# EasyEDA Pro project 干电池充电器.eprj, schematic Schematic1
Board Name: Board1; Create Date: 2025-11-15; Page Name: P1; Project Name: 干电池充电器; Schematic Name: Schematic1; Update Date: 2025-11-17; Company: 嘉立创EDA; Page Size: A4; Version: V1.0
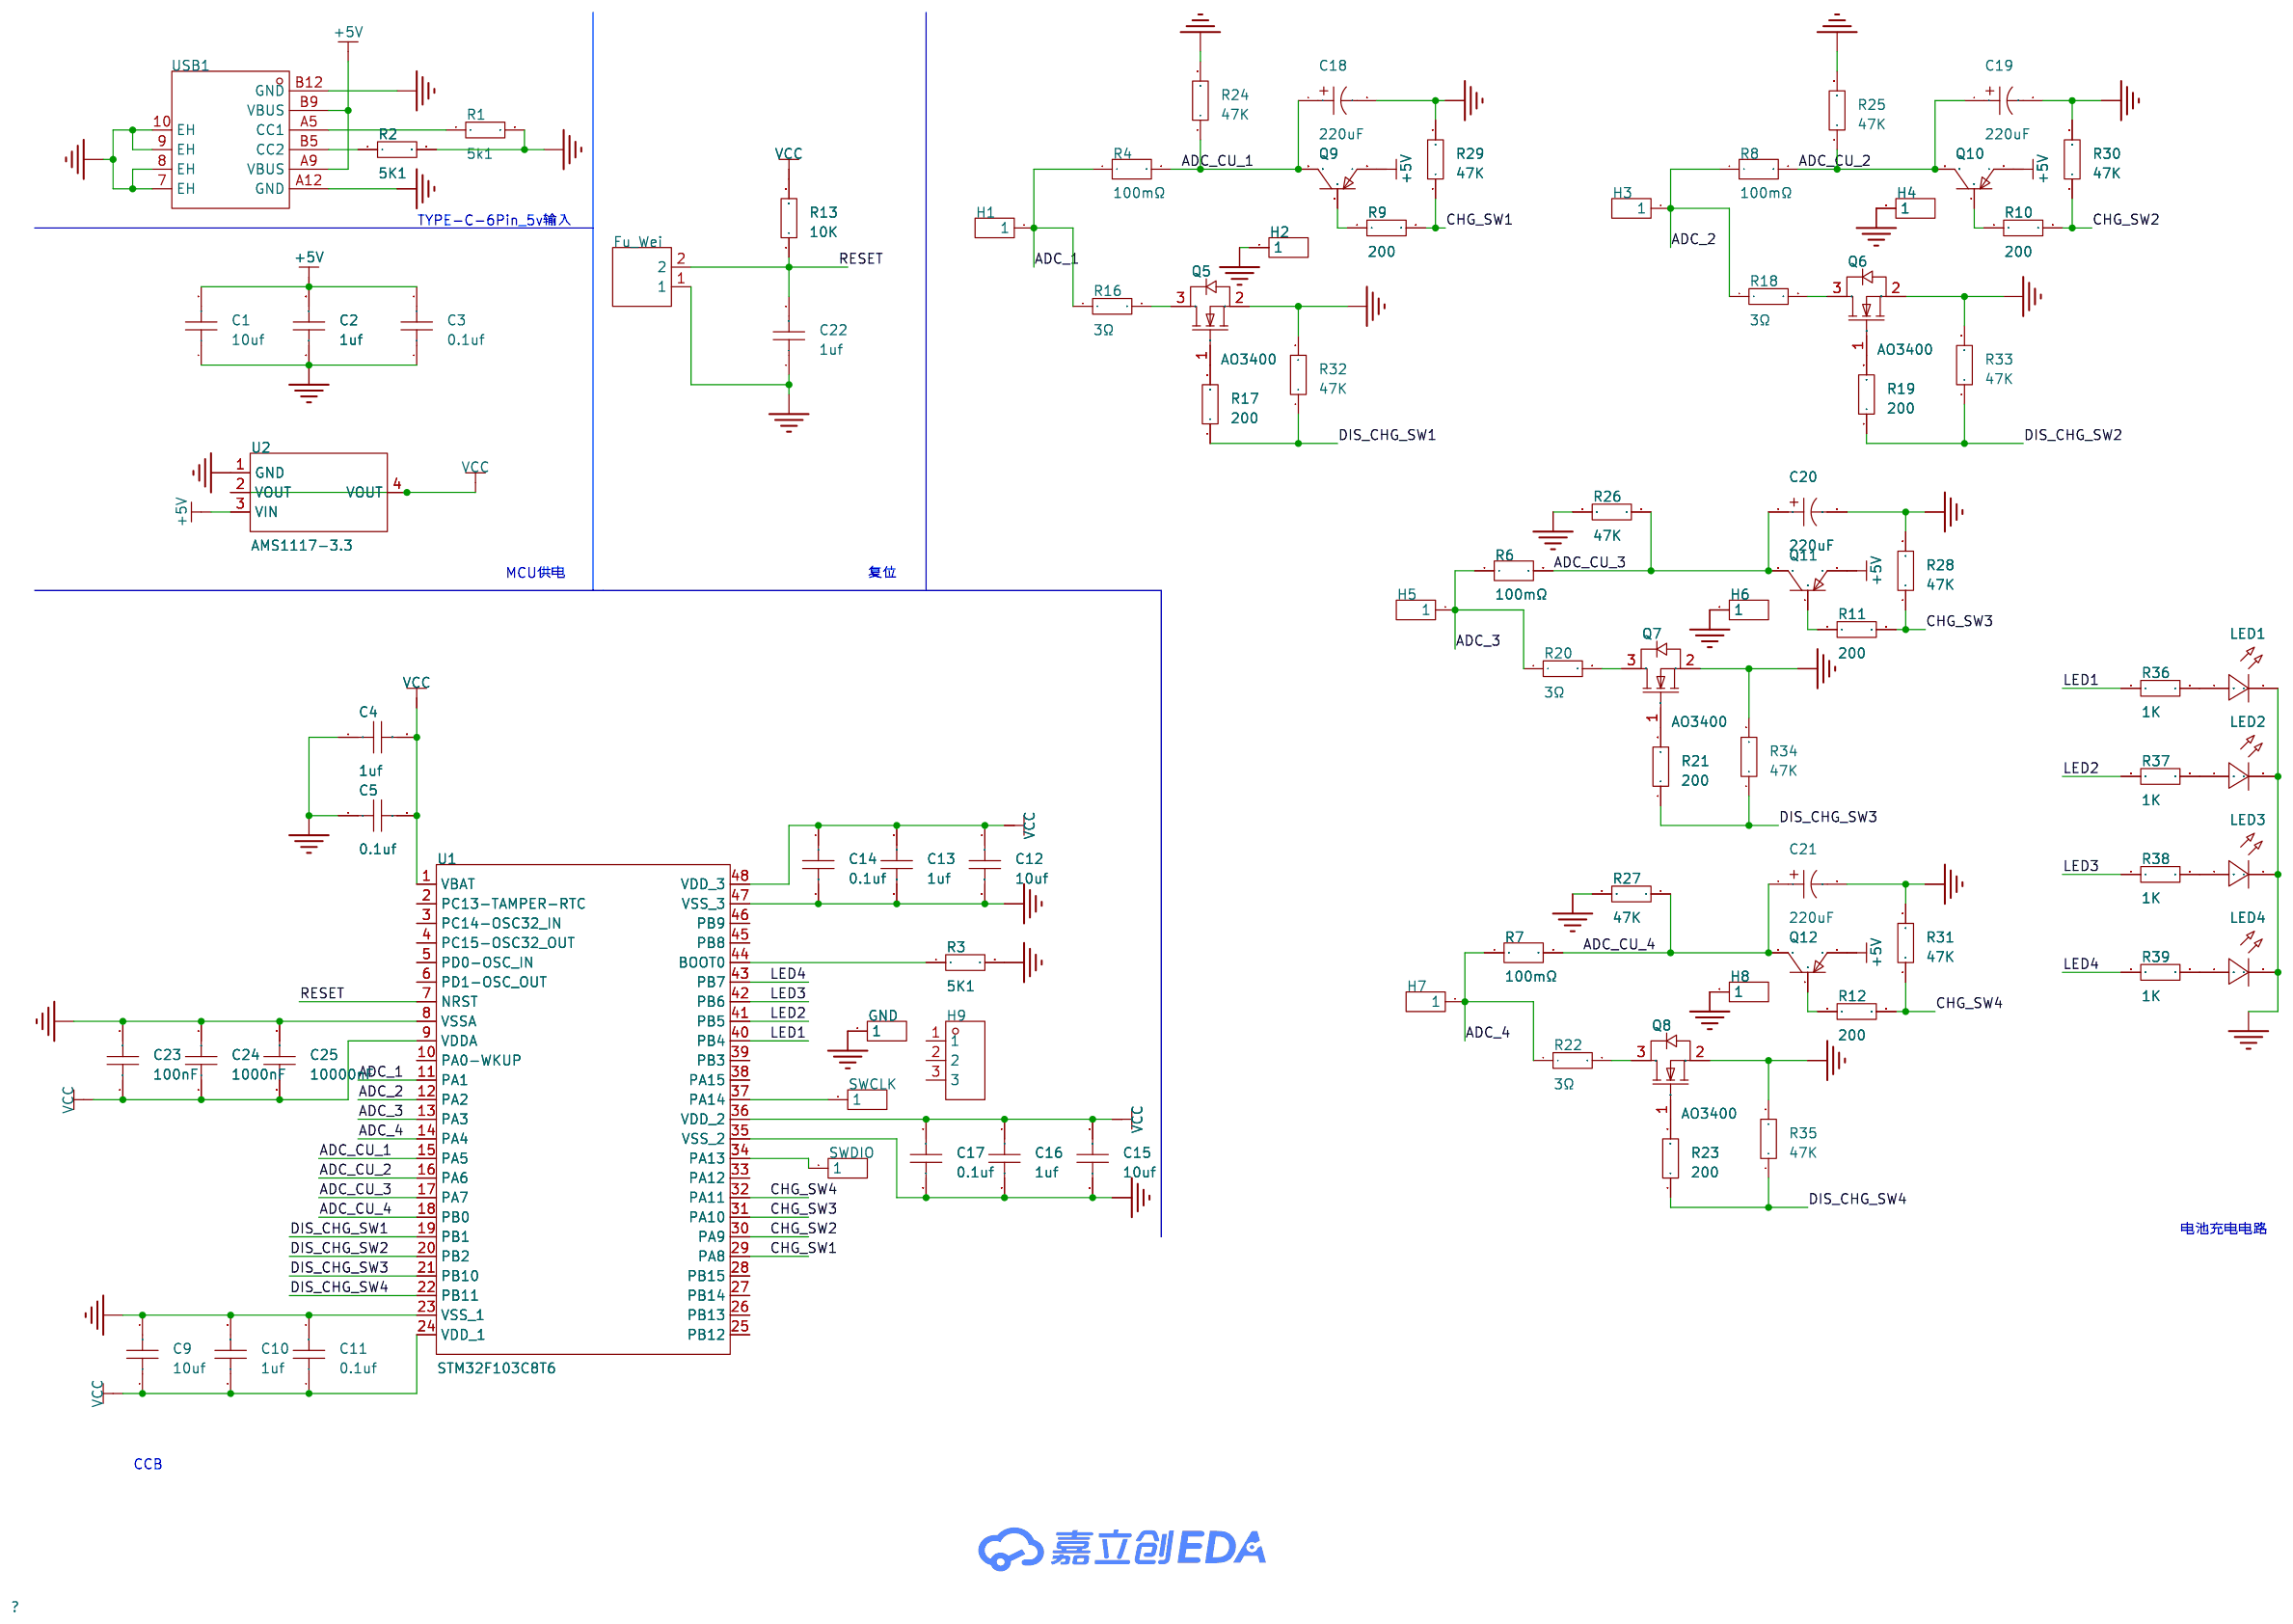
[diagram p0: schematic sheet]

## Parts
C1  10uf  [D0805]
C2  1uf  [D0805]
C3  0.1uf  [D0805]
C4  1uf  [D0805]
C5  0.1uf  [D0805]
C9  10uf  [D0805]
C10  1uf  [D0805]
C11  0.1uf  [D0805]
C12  10uf  [D0805]
C13  1uf  [D0805]
C14  0.1uf  [D0805]
C15  10uf  [D0805]
C16  1uf  [D0805]
C17  0.1uf  [D0805]
C18  220uF  [CAP-SMD_L6.0-W3.2]
C19  220uF  [CAP-SMD_L6.0-W3.2]
C20  220uF  [CAP-SMD_L6.0-W3.2]
C21  220uF  [CAP-SMD_L6.0-W3.2]
C22  1uf  [C0805]
C23  100nF  [C0805]
C24  1000nF  [C0805]
C25  10000nF  [C0805]
Fu_Wei  -  [HDR-TH_2P-P2.54-V-M-1]
GND  -  [HDR-TH_1P-V-M_XKB_X4611WV-01I-C28D40]
H1  -  [HDR-TH_1P-V-M_XKB_X4611WV-01I-C28D40]
H2  -  [HDR-TH_1P-V-M_XKB_X4611WV-01I-C28D40]
H3  -  [HDR-TH_1P-V-M_XKB_X4611WV-01I-C28D40]
H4  -  [HDR-TH_1P-V-M_XKB_X4611WV-01I-C28D40]
H5  -  [HDR-TH_1P-V-M_XKB_X4611WV-01I-C28D40]
H6  -  [HDR-TH_1P-V-M_XKB_X4611WV-01I-C28D40]
H7  -  [HDR-TH_1P-V-M_XKB_X4611WV-01I-C28D40]
H8  -  [HDR-TH_1P-V-M_XKB_X4611WV-01I-C28D40]
H9  -  [HDR-TH_3P-P2.54-V-M]
LED1  -  [LED_TH-3mm]
LED2  -  [LED_TH-3mm]
LED3  -  [LED_TH-3mm]
LED4  -  [LED_TH-3mm]
Q5  AO3400  [SOT-23_L2.9-W1.3-P1.90-LS2.4-BR]
Q6  AO3400  [SOT-23_L2.9-W1.3-P1.90-LS2.4-BR]
Q7  AO3400  [SOT-23_L2.9-W1.3-P1.90-LS2.4-BR]
Q8  AO3400  [SOT-23_L2.9-W1.3-P1.90-LS2.4-BR]
Q9  -  [S8550P_SOT]
Q10  -  [S8550P_SOT]
Q11  -  [S8550P_SOT]
Q12  -  [S8550P_SOT]
R1  5k1  [R0603]
R2  5K1  [R0603]
R3  5K1  [R0603]
R4  100mΩ  [R2512]
R6  100mΩ  [R2512]
R7  100mΩ  [R2512]
R8  100mΩ  [R2512]
R9  200  [R0805]
R10  200  [R0805]
R11  200  [R0805]
R12  200  [R0805]
R13  10K  [R0805]
R16  3Ω  [R2512]
R17  200  [R0805]
R18  3Ω  [R2512]
R19  200  [R0805]
R20  3Ω  [R2512]
R21  200  [R0805]
R22  3Ω  [R2512]
R23  200  [R0805]
R24  47K  [R0805]
R25  47K  [R0805]
R26  47K  [R0805]
R27  47K  [R0805]
R28  47K  [R0805]
R29  47K  [R0805]
R30  47K  [R0805]
R31  47K  [R0805]
R32  47K  [R0805]
R33  47K  [R0805]
R34  47K  [R0805]
R35  47K  [R0805]
R36  1K  [R0805]
R37  1K  [R0805]
R38  1K  [R0805]
R39  1K  [R0805]
SWCLK  -  [HDR-TH_1P-V-M_XKB_X4611WV-01I-C28D40]
SWDIO  -  [HDR-TH_1P-V-M_XKB_X4611WV-01I-C28D40]
U1  STM32F103C8T6  [LQFP-48_L7.0-W7.0-P0.50-LS9.0-BL]
U2  AMS1117-3.3  [SOT-223-3_L6.5-W3.4-P2.30-LS7.0-BR]
USB1  -  [USB_ TYPE-C-6P]

## Library data of the parts
C1-C5 C9-C17 = CAP_0603: Supplier Footprint: 0603
C18-C21 = T520C227M006ATE045: LCSC Part Name: 220uF ±20% 6.3V; Supplier Part: C561781; Manufacturer: KEMET(基美); Supplier Footprint: CASE-C-6032; JLCPCB Part Class: Extended Part; Datasheet: https://item.szlcsc.com/datasheet/T520C227M006ATE045/587302.html; Supplier: LCSC; Tolerance: ±20%; Voltage Rating: 6.3V; Equivalent Series Resistance(ESR): 45mΩ@100kHz; Operating Temperature: -55℃~+105℃
C22-C25 = CAP_0805: Supplier Footprint: 0805
Fu_Wei = HDR-M_2.54_1x2P: Supplier Part: C124375; Supplier Footprint: 插件
GND H1-H8 SWCLK SWDIO = HDR-M_2.54_1x1P: Supplier Part: C81276; Supplier Footprint: 插件; JLCPCB Part Class: Extended Part
H9 = HDR-M_2.54_1x3P: Supplier Part: C2937625; Supplier Footprint: 插件
LED1-LED4 = LED_TH-R_3mm: Supplier Footprint: 插件
Q5-Q8 = AO3400_C2938367: LCSC Part Name: 1个N沟道 耐压:30V 电流:5.8A; Supplier Part: C2938367; Manufacturer: GOODWORK(固得沃克); Supplier Footprint: SOT-23; JLCPCB Part Class: 扩展库; Datasheet: https://item.szlcsc.com/datasheet/AO3400/3294704.html; Supplier: LCSC; Number: 1个N沟道; Drain to Source Voltage: 30V; Current - Continuous Drain(Id): 5.8A; RDS(on): 28mΩ@10V; Pd - Power Dissipation: 1.5W; Gate Threshold Voltage (Vgs(th)): 1.4V@250uA; Input Capacitance(Ciss): 1.05nF; Reverse Transfer Capacitance (Crss@Vds): 77pF@15V; Operating Temperature: -55℃~+150℃; Type: N沟道
Q9-Q12 = S8550_SOT_PNP: Supplier Footprint: SOT-23
R1-R3 = Res_0603: Supplier Footprint: 0603
R4 R6-R8 = RE2512F3R100: LCSC Part Name: 100mΩ 3W 2512 ±1%; Supplier Part: C46961760; Manufacturer: JIERR(捷而瑞); Supplier Footprint: 2512; JLCPCB Part Class: 扩展库; Datasheet: https://item.szlcsc.com/datasheet/RE2512F3R100/49133299.html; Supplier: LCSC; Type: 采样电阻；合金电阻; Tolerance: ±1%; Power(Watts): 3W; Temperature Coefficient: ±50ppm/℃
R9-R13 R17 R19 R21 R23-R39 = Res_0805: Supplier Footprint: 0805
R16 R18 R20 R22 = 25121WJ030JT4E: LCSC Part Name: 3Ω ±5% 1W 厚膜电阻; Supplier Part: C25486; Manufacturer: UNI-ROYAL(厚声); Supplier Footprint: 2512; JLCPCB Part Class: 扩展库; Datasheet: https://atta.szlcsc.com/upload/public/pdf/source/20200306/C422600_1E6D84923E4A46A82E41ADD87F860B5C.pdf; Supplier: LCSC; Type: 厚膜电阻; Tolerance: ±5%; Power(Watts): 1W; Overload Voltage (Max): 200V; Temperature Coefficient: ±200ppm/℃; Operating Temperature Range: -55℃~+155℃
U1 = STM32F103C8T6: LCSC Part Name: 主流增强型ARM Cortex-M3 MCU，具有64 KB Flash、72 MHz CPU、电机控制、USB和CAN; Supplier Part: C8734; Manufacturer: ST(意法半导体); Supplier Footprint: LQFP-48(7x7); JLCPCB Part Class: 扩展库; Datasheet: https://item.szlcsc.com/datasheet/STM32F103C8T6/9243.html; Supplier: LCSC; CPU Core: ARM-M3; CPU Maximum Speed: 72MHz; Program Storage Size: 64KB; Program Memory Type: FLASH; Number of I/O: 37; ADC (Bit): 12bit; Voltage - Supply: 2V~3.6V
U2 = AMS1117-3.3_C6186: LCSC Part Name: 输出3.3V 1A; Supplier Part: C6186; Manufacturer: AMS; Supplier Footprint: SOT-223; JLCPCB Part Class: 基础库; Datasheet: https://item.szlcsc.com/datasheet/AMS1117-3.3/6652.html; Supplier: LCSC; Output Type: 固定; Voltage - Supply: 16V; Output Voltage: 3.3V; Output Current: 1A; Power Supply Rejection Ratio (PSRR): 72dB@(120Hz); Voltage Dropout: 1.1V@(800mA); standby current: 5mA; Noise: 0.003%Vout; Features: 过流保护；过热保护; Operating Temperature: -40℃~+125℃; Output Configuration: 正极; Number of Outputs: 1
USB1 = USB_ Type-C-6P: Supplier Footprint: SMD

## Nets
+5V: C1.2 C2.2 C3.2 Q9.2(E) Q10.2(E) Q11.2(E) Q12.2(E) U2.3(VIN) USB1.A9(VBUS) USB1.B9(VBUS)
GND: C1.1 C2.1 C3.1 C4.1 C5.1 C9.2 C10.2 C11.2 C12.2 C13.2 C14.2 C15.2 C16.2 C17.2 C18.2 C19.2 C20.2 C21.2 C22.1 C23.2 C24.2 C25.2 Fu_Wei.1 GND.1 H2.1 H4.1 H6.1 H8.1 LED1.2(A) LED2.2(A) LED3.2(A) LED4.2(A) Q5.2(S) Q6.2(S) Q7.2(S) Q8.2(S) R1.2 R2.2 R3.2 R24.2 R25.2 R26.2 R27.2 R28.2 R29.2 R30.2 R31.2 R32.2 R33.2 R34.2 R35.2 U1.8(VSSA) U1.23(VSS_1) U1.35(VSS_2) U1.47(VSS_3) U2.1(GND) USB1.7(EH) USB1.8(EH) USB1.9(EH) USB1.10(EH) USB1.A12(GND) USB1.B12(GND)
VCC: C4.2 C5.2 C9.1 C10.1 C11.1 C12.1 C13.1 C14.1 C15.1 C16.1 C17.1 C23.1 C24.1 C25.1 R13.2 U1.1(VBAT) U1.9(VDDA) U1.24(VDD_1) U1.36(VDD_2) U1.48(VDD_3) U2.2(VOUT) U2.4(VOUT)
ADC_1: H1.1 R4.1 R16.1 U1.11(PA1)
ADC_2: H3.1 R8.1 R18.1 U1.12(PA2)
ADC_3: H5.1 R6.1 R20.1 U1.13(PA3)
ADC_4: H7.1 R7.1 R22.1 U1.14(PA4)
ADC_CU_1: C18.1 Q9.3(C) R4.2 R24.1 U1.15(PA5)
ADC_CU_2: C19.1 Q10.3(C) R8.2 R25.1 U1.16(PA6)
ADC_CU_3: C20.1 Q11.3(C) R6.2 R26.1 U1.17(PA7)
ADC_CU_4: C21.1 Q12.3(C) R7.2 R27.1 U1.18(PB0)
CHG_SW1: R9.2 R29.1 U1.29(PA8)
CHG_SW2: R10.2 R30.1 U1.30(PA9)
CHG_SW3: R11.2 R28.1 U1.31(PA10)
CHG_SW4: R12.2 R31.1 U1.32(PA11)
DIS_CHG_SW1: R17.1 R32.1 U1.19(PB1)
DIS_CHG_SW2: R19.1 R33.1 U1.20(PB2)
DIS_CHG_SW3: R21.1 R34.1 U1.21(PB10)
DIS_CHG_SW4: R23.1 R35.1 U1.22(PB11)
LED1: R36.1 U1.40(PB4)
LED2: R37.1 U1.41(PB5)
LED3: R38.1 U1.42(PB6)
LED4: R39.1 U1.43(PB7)
RESET: C22.2 Fu_Wei.2 R13.1 U1.7(NRST)
$1N759: R1.1 USB1.A5(CC1)
$1N785: R2.1 USB1.B5(CC2)
$1N1881: R3.1 U1.44(BOOT0)
$1N2574: SWDIO.1 U1.34(PA13)
$1N2624: SWCLK.1 U1.37(PA14)
$1N2965: Q9.1(B) R9.1
$1N2970: Q10.1(B) R10.1
$1N2976: Q11.1(B) R11.1
$1N2981: Q12.1(B) R12.1
$1N4284: Q5.3(D) R16.2
$1N4449: Q5.1(G) R17.2
$1N4597: Q6.3(D) R18.2
$1N4599: Q6.1(G) R19.2
$1N4723: Q7.3(D) R20.2
$1N4725: Q7.1(G) R21.2
$1N4849: Q8.3(D) R22.2
$1N4851: Q8.1(G) R23.2
$1N5986: LED1.1(C) R36.2
$1N6012: LED2.1(C) R37.2
$1N6038: LED3.1(C) R38.2
$1N6064: LED4.1(C) R39.2

Not connected (* = marked no-connect by the designer): H9 1 2 3; U1 2(PC13-TAMPER-RTC) 3(PC14-OSC32_IN) 4(PC15-OSC32_OUT) 5(PD0-OSC_IN) 6(PD1-OSC_OUT) 10(PA0-WKUP) 25(PB12) 26(PB13) 27(PB14) 28(PB15) 33(PA12) 38(PA15) 39(PB3) 45(PB8) 46(PB9)

## Notes on the sheet
- TYPE-C-6Pin_5v输入
- MCU供电
- 复位
- 电池充电电路
- CCB
